# Altium schematic sheet Systolic.SchDoc: Systolic
size A4
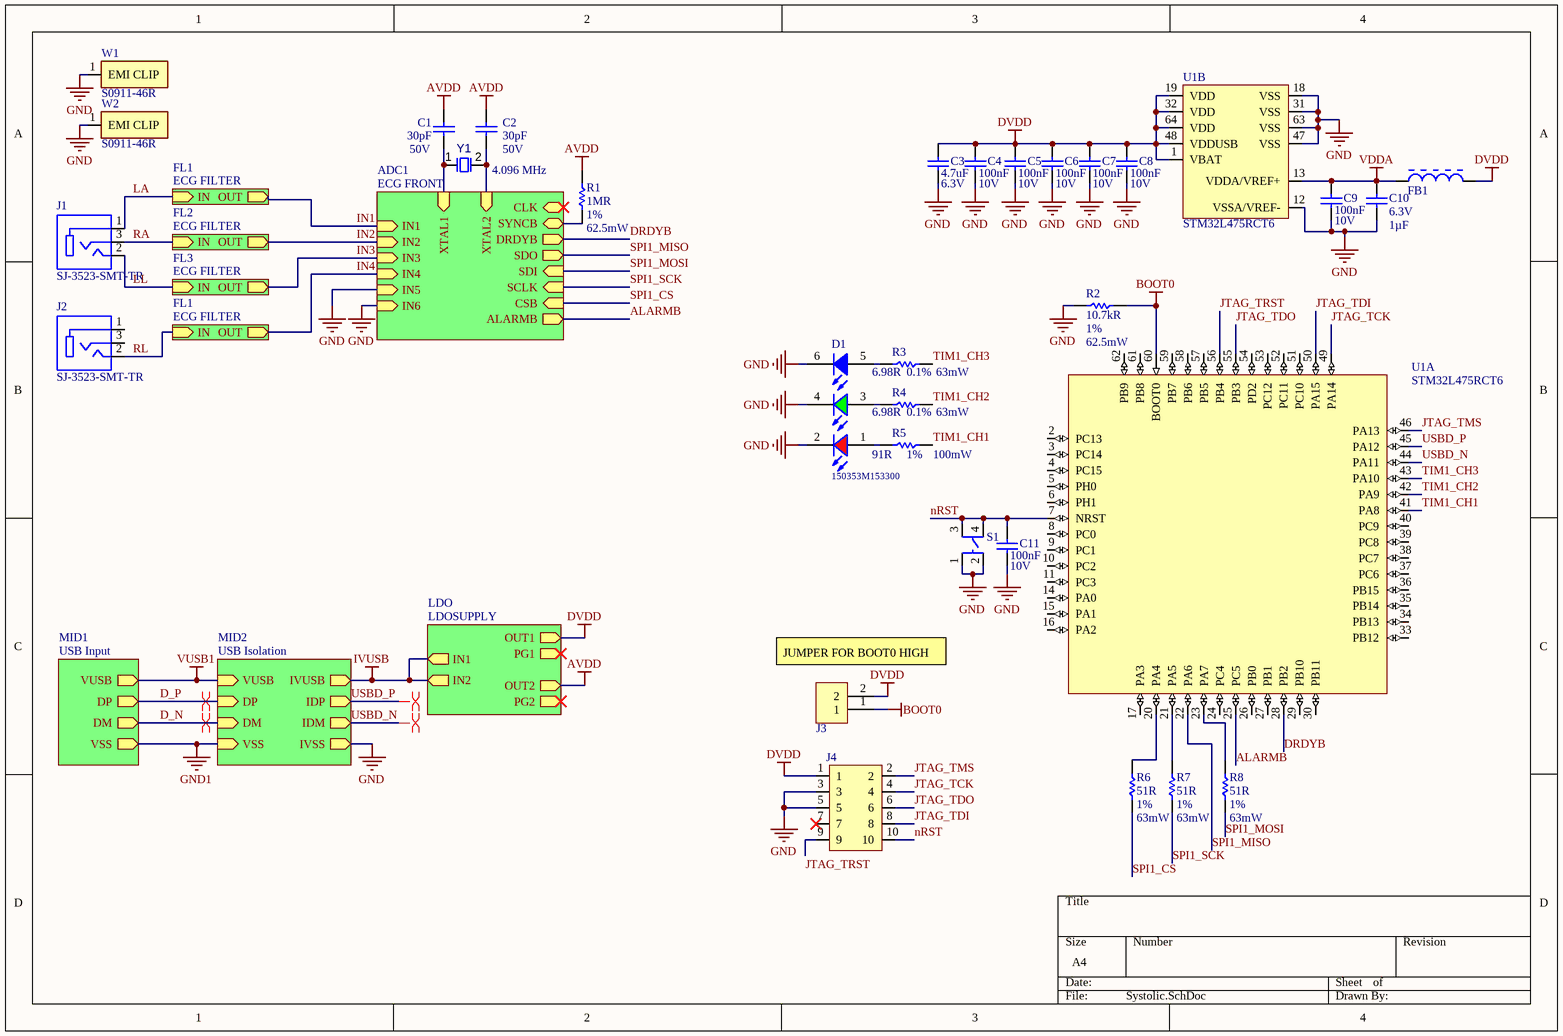
[diagram p0: Systolic.SchDoc]

## Parts
C1  Capacitance: 30pF  Voltage Rating: 50V  [0402 CAPACITOR]  (hidden comment: MC0402N300J500CT)
C2  Capacitance: 30pF  Voltage Rating: 50V  [0402 CAPACITOR]  (hidden comment: MC0402N300J500CT)
C3  Capacitance: 4.7uF  Voltage Rating: 6.3V  [0402 CAPACITOR]  (hidden comment: CL10A475KQ8NNNC)
C4  Capacitance: 100nF  Voltage Rating: 10V  [0402 CAPACITOR]  (hidden comment: C0402C104K8PACTU)
C5  Capacitance: 100nF  Voltage Rating: 10V  [0402 CAPACITOR]  (hidden comment: C0402C104K8PACTU)
C6  Capacitance: 100nF  Voltage Rating: 10V  [0402 CAPACITOR]  (hidden comment: C0402C104K8PACTU)
C7  Capacitance: 100nF  Voltage Rating: 10V  [0402 CAPACITOR]  (hidden comment: C0402C104K8PACTU)
C8  Capacitance: 100nF  Voltage Rating: 10V  [0402 CAPACITOR]  (hidden comment: C0402C104K8PACTU)
C9  Capacitance: 100nF  Voltage Rating: 10V  [0402 CAPACITOR]  (hidden comment: C0402C104K8PACTU)
C10  value 1µF  Voltage Rating (DC): 6.3V  [0402 CAPACITOR]  (hidden comment: C0402C105K9PACTU)
C11  Capacitance: 100nF  Voltage Rating: 10V  [0402 CAPACITOR]  (hidden comment: C0402C104K8PACTU)
D1  150353M153300  [WL-SFTD_3535]
FB1  BLM15AX601SN1D  [0402 RESISTOR]  (value not drawn)
J1  SJ-3523-SMT-TR  [CUI_SJ-3523-SMT-TR]
J2  SJ-3523-SMT-TR  [CUI_SJ-3523-SMT-TR]
J3  SAMTEC-TSW-102-07-X-SJ  [SAMTEC-TSW-102-07-X-S]  (value not drawn)
J4  FTSH-105-01-L-DV-K-P  [FTSH-105-01-L-DV-K-P]  (value not drawn)
R1  Resistance: 1MR  Tolerance: 1%  Power Rating: 62.5mW  [0402 RESISTOR]  (hidden comment: MCWR04X1004FTL)
R2  Resistance: 10.7kR  Tolerance: 1%  Power Rating: 62.5mW  [0402 RESISTOR]  (hidden comment: MCWR04X1072FTL)
R3  Resistance: 6.98R  Tolerance: 0.1%  Power Rating: 63mW  [0603 RESISTOR]  (hidden comment: RN73C1J6R98BTDF)
R4  Resistance: 6.98R  Tolerance: 0.1%  Power Rating: 63mW  [0603 RESISTOR]  (hidden comment: RN73C1J6R98BTDF)
R5  Resistance: 91R  Tolerance: 1%  Power Rating: 100mW  [0603 RESISTOR]  (hidden comment: CRCW060391R0FKEA)
R6  Resistance: 51R  Tolerance: 1%  Power Rating: 63mW  [0402 RESISTOR]  (hidden comment: CRCW040251R0FKED)
R7  Resistance: 51R  Tolerance: 1%  Power Rating: 63mW  [0402 RESISTOR]  (hidden comment: CRCW040251R0FKED)
R8  Resistance: 51R  Tolerance: 1%  Power Rating: 63mW  [0402 RESISTOR]  (hidden comment: CRCW040251R0FKED)
S1  TL3305BF260QG  [TL3305BF260QG-Footprint-1]  (value not drawn)
U1  STM32L475RCT6  [TSQFP50P1200X1200X160-64N]  (parts A,B of 2)
W1  S0911-46R  [S0911-46R-Footprint-1]
W2  S0911-46R  [S0911-46R-Footprint-1]
Y1  Frequency: 4.096 MHz  [Crystal]  (hidden comment: ABLS-4.096MHZ-20-B-4-Y-T)

## Sub-sheets
ADC1 = ECG FRONT: IN1 (in), IN2 (in), IN3 (in), DRDYB (out), SDO (out), SDI (in), SCLK (in), CSB (in), ALARMB (out), CLK (bidir), XTAL1 (in), XTAL2 (in), SYNCB (bidir), IN6 (in), IN4 (in), IN5 (in)
FL1 = ECG FILTER: OUT (out), IN (in)
FL1 = ECG FILTER: OUT (out), IN (in)
FL2 = ECG FILTER: OUT (out), IN (in)
FL3 = ECG FILTER: OUT (out), IN (in)
LDO = LDOSUPPLY: IN1 (out), PG1 (out), PG2 (out), IN2 (out), OUT1 (out), OUT2 (out)
MID1 = USB Input: VUSB (out), DP (out), DM (out), VSS (out)
MID2 = USB Isolation: VUSB (in), DP (in), DM (in), VSS (in), IVUSB (out), IDP (out), IDM (out), IVSS (out)

## Nets
AVDD: C1.2 C2.2 R1.1 ; sheet LDO/OUT2
BOOT0: J3.1 R2.2 U1.60(BOOT0)
DVDD: C3.2 C4.2 C5.2 C6.2 C7.2 C8.2 FB1.2 J3.2 J4.1 U1.1(VBAT) U1.19(VDD) U1.32(VDD) U1.48(VDDUSB) U1.64(VDD) ; sheet LDO/OUT1
GND: C3.1 C4.1 C5.1 C6.1 C7.1 C8.1 C9.1 C10.1 C11.1 D1.2(K) D1.4(K) D1.6(K) J4.3 J4.5 R2.1 S1.1 S1.2 U1.12(VSSA/VREF-) U1.18(VSS) U1.31(VSS) U1.47(VSS) U1.63(VSS) W1.1(EMI_CLIP) W2.1(EMI_CLIP) ; sheet MID2/IVSS, sheet ADC1/IN6, sheet ADC1/IN5
GND1: sheet MID1/VSS, sheet MID2/VSS
IVUSB: sheet MID2/IVUSB, sheet LDO/IN1, sheet LDO/IN2
VDDA: C9.2 C10.2 FB1.1 U1.13(VDDA/VREF+)
VUSB1: sheet MID1/VUSB, sheet MID2/VUSB
ALARMB: U1.25(PC5) ; sheet ADC1/ALARMB
D_N: sheet MID1/DM, sheet MID2/DM
D_P: sheet MID1/DP, sheet MID2/DP
DRDYB: U1.28(PB2) ; sheet ADC1/DRDYB
IN1: sheet ADC1/IN1, sheet FL1/OUT
IN2: sheet ADC1/IN2, sheet FL2/OUT
IN3: sheet ADC1/IN3, sheet FL3/OUT
IN4: sheet ADC1/IN4, sheet FL1/OUT
JTAG_TCK: J4.4 U1.49(PA14)
JTAG_TDI: J4.8 U1.50(PA15)
JTAG_TDO: J4.6 U1.55(PB3)
JTAG_TMS: J4.2 U1.46(PA13)
JTAG_TRST: J4.9 U1.56(PB4)
LA: J1.1 ; sheet FL1/IN
LL: J1.2 ; sheet FL3/IN
nRST: C11.2 J4.10 S1.3 S1.4 U1.7(NRST)
RA: J1.3 ; sheet FL2/IN
RL: J2.2 ; sheet FL1/IN
SPI1_CS: R6.1 ; sheet ADC1/CSB
SPI1_MISO: U1.22(PA6) ; sheet ADC1/SDO
SPI1_MOSI: R8.1 ; sheet ADC1/SDI
SPI1_SCK: R7.1 ; sheet ADC1/SCLK
TIM1_CH1: R5.2 U1.41(PA8)
TIM1_CH2: R4.2 U1.42(PA9)
TIM1_CH3: R3.2 U1.43(PA10)
USBD_N: U1.44(PA11) ; sheet MID2/IDM
USBD_P: U1.45(PA12) ; sheet MID2/IDP
NetC1_1: C1.1 Y1.1 ; sheet ADC1/XTAL1
NetC2_1: C2.1 Y1.2 ; sheet ADC1/XTAL2
NetD1_1: D1.1(A) R5.1
NetD1_3: D1.3(A) R4.1
NetD1_5: D1.5(A) R3.1
NetR1_2: R1.2 ; sheet ADC1/SYNCB
NetR6_2: R6.2 U1.20(PA4)
NetR7_2: R7.2 U1.21(PA5)
NetR8_2: R8.2 U1.23(PA7)

Not connected (* = marked no-connect by the designer): J2 1 3; J4 7*; U1 2(PC13) 3(PC14) 4(PC15) 5(PH0) 6(PH1) 8(PC0) 9(PC1) 10(PC2) 11(PC3) 14(PA0) 15(PA1) 16(PA2) 17(PA3) 24(PC4) 26(PB0) 27(PB1) 29(PB10) 30(PB11) 33(PB12) 34(PB13) 35(PB14) 36(PB15) 37(PC6) 38(PC7) 39(PC8) 40(PC9) 51(PC10) 52(PC11) 53(PC12) 54(PD2) 57(PB5) 58(PB6) 59(PB7) 61(PB8) 62(PB9)

## Layout directives
differential pair; differential pair class USB: D_N, D_P, USBD_N, USBD_P

## Notes on the sheet
- (near J3) JUMPER FOR BOOT0 HIGH

## Library data of the parts
C1 C2 = CMP-001-00092-2: Cap Ceramic 30pF 50V C0G 5% SMD 0402 125°C; Temperature Coefficient: 30ppm/°C; Packaging: Cut Tape; Case/Package: 0402; Min Operating Temperature: -55°C; Number of Pins: 2; Voltage Rating (DC): 50V; Case Code (Imperial): 0402; Max Operating Temperature: 125°C; REACH SVHC: No SVHC; Case Code (Metric): 1005; Width: 0.5mm; Dielectric: C0G; Tolerance: 5%
C3 = CMP-001-00091-2: Cap Ceramic 4.7uF 6.3V X5R 10% SMD 0402 85°C; Max Operating Temperature: 85°C; Radiation Hardening: No; Voltage: 6.3V; Case Code (Metric): 1608; Case/Package: 0603; Tolerance: 10%; Dielectric: X5R; Mount: Surface Mount; Packaging: Tape and Reel; Height: 0.8mm; Thickness: 0.035inch; Length: 1.6mm; Contact Plating: Tin; Package Quantity: 1; Depth: 0.8mm; Min Operating Temperature: -55°C; Width: 0.031inch; Material: Ceramic; Case Code (Imperial): 0603
C4-C9 C11 = CMP-001-00061-5: Cap Ceramic 0.1uF 10V X5R 10% SMD 0402 85°C; Dissipation Factor: 5%; Number of Pins: 2; Case Code (Metric): 1005; Min Operating Temperature: -55°C; Thickness: 0.022inch; Radiation Hardening: No; Packaging: Tape and Reel; Depth: 0.5mm; Voltage: 10V; Lead Pitch: 0.3mm; Voltage Rating (DC): 10V; Mount: Surface Mount,PCB; Max Operating Temperature: 85°C; Termination: SMD/SMT; Case Code (Imperial): 0402; Width: 0.02inch; REACH SVHC: No SVHC; Contact Plating: Tin,Matte; Length: 1mm; Package Quantity: 1; Dielectric: X5R; Tolerance: 10%; Lead Free: Lead Free; Dielectric Material: Ceramic; Case/Package: 0402; Height: 0.5mm
C10 = CMP-009-0032-3: CAP CER 1UF 6.3V 10% X5R 0402; Manufacturer: KEMET; Dielectric Material: Ceramic; ComponentLink2URL: https://datasheet.ciiva.com/11786/0900766b8116eb59-11786028.pdf?src-supplier=RSComponents; Mount: Surface Mount; REACH SVHC: No SVHC; Height: 0.5mm; Max Operating Temperature: 85°C; ComponentLink5Description: https://datasheet.ciiva.com/18192/getdatasheetpartid-127800-18192427.pdf?src-supplier=Verical; Category: Ceramic Capacitors; Package Quantity: 1; Manufacturer Part Number: C0402C105K9PACTU; ComponentLink5URL: https://datasheet.ciiva.com/18192/getdatasheetpartid-127800-18192427.pdf?src-supplier=Verical; Case/Package: 0402; Tolerance: 10%; Packaging: Tape and Reel; ComponentLink4Description: https://datasheet.ciiva.com/7747/40889-7747623.pdf?src-supplier=Element14; Width: 0.02inch; RoHS: Yes; Depth: 0.5mm; ComponentLink1URL: https://datasheet.ciiva.com/28645/1789732-28645392.pdf?src-supplier=Element14; Length: 1mm; Source: MyLib.SchLib; Stock 1: 76830; Lead Pitch: 0.3mm; Pins: 2; Thickness: 0.022inch; Termination: SMD/SMT; ComponentLink3URL: https://datasheet.ciiva.com/7747/kem-c1006-x5r-smd-7747445.pdf?src-supplier=Element14; Pricing 1: 10=0.02950, 100=0.01910, 500=0.01410, 2500=0.01080, 5000=0.00930 (GBP); ComponentLink1Description: https://datasheet.ciiva.com/28645/1789732-28645392.pdf?src-supplier=Element14; ComponentLink2Description: https://datasheet.ciiva.com/11786/0900766b8116eb59-11786028.pdf?src-supplier=RSComponents; Design Item ID: C0402C105K9PACTU; Radiation Hardening: No; Voltage Rating: 6.3V; ComponentLink4URL: https://datasheet.ciiva.com/7747/40889-7747623.pdf?src-supplier=Element14; Min Operating Temperature: -55°C; Dielectric: X5R; Voltage: 6.3V; ComponentLink3Description: https://datasheet.ciiva.com/7747/kem-c1006-x5r-smd-7747445.pdf?src-supplier=Element14; Lead Free: Lead Free
D1 = CMP-080-0003-1: WL-SFTD SMT Full-color Top LED Diffused, size 3535, Red & Green & Blue, 120deg; Dominant Wavelength typ.: Blue:470nm, Green:520nm, Red:625nm; Peak Wavelength typ.: Blue:465nm, Green:515nm, Red:635nm; Luminous Intensity typ.: Blue:400mcd, Green:1900mcd, Red:800mcd; Chip Technology: AlInGaP + GaN; Forward Voltage typ.: Blue:3.2V, Green:3.2V, Red:2V; Published Date: December 2019; Viewing Angle: 120deg; ComponentLink2Description: Datasheet; ComponentLink2URL: https://www.we-online.com/catalog/datasheet/150353M153300.pdf; ComponentLink1Description: Manufacturer; Part Number: 150353M153300; Publisher: Wurth Elektronik; ComponentLink1URL: http://www.we-online.de; Operating Temperature: -40 to +85degC; Packaging: Tape and Reel; Source: WL-SFTD.SchLib; Mounting Technology: SMT; Emitting Color: Red & Green & Blue; Design Item ID: 150353M153300; Size: 3535
FB1 = CMP-006-00023-1: Ferrite Beads Multi-Layer 600Ohm 25% 100MHz 500mA 340mOhm DCR 0402 T/R; Number of Lines: 1; DC Resistance (DCR): 340mR; Material: Steel,Ferrite; Impedance: 600R; Core Material: Ferrite; Width: 0.5mm; Lead Free: Lead Free; Case/Package: 0402; Max Current Rating: 500mA; Number of Pins: 2; Case Code (Metric): 1005; Case Code (Imperial): 0402; Min Operating Temperature: -55°C; REACH SVHC: No SVHC; Length: 1mm; Termination: SMD/SMT; Package Quantity: 1; Tolerance: 25%; Current Rating: 500mA; Depth: 0.5mm; Height: 0.5mm; Max Operating Temperature: 125°C; Number of Circuits: 1; Test Frequency: 100MHz; Packaging: Tape and Reel; Max DC Current: 500mA
J1 J2 = CMP-023-0000-1: CONN JACK STEREO 3.5MM SMD R/A; Manufacturer 1: CUI; MF: CUI Devices; Number of Conductors: 3; Shielding: Unshielded; Current Rating: 1A; Number of Ports: 1; Gender: Female; ComponentLink2Description: https://datasheet.ciiva.com/7356/sj-352x-smt-series-7356569.pdf?src-supplier=Digi-Key; Availability: Unavailable; Case/Package: LGA-10 STMicroelectronics; ComponentLink2URL: https://datasheet.ciiva.com/7356/sj-352x-smt-series-7356569.pdf?src-supplier=Digi-Key; Price: None; Color: Black; ComponentLink1URL: https://datasheet.ciiva.com/7356/sj-352x-smt-series-7356553.pdf?src-supplier=Digi-Key; Pricing 1: 1000=0.51360, 2000=0.48150, 3000=0.46545, 5000=0.44940, 10000=0.42693, 25000=0.41730 (USD); Stock 1: 40782; Connector Type: Jack; Termination: Solder; Design Item ID: SJ-3523-SMT-TR; Lead Free: Lead Free; Contact Plating: Silver; Value: *; MP: SJ-3523-SMT-TR; ComponentLink1Description: https://datasheet.ciiva.com/7356/sj-352x-smt-series-7356553.pdf?src-supplier=Digi-Key; SnapEDA_Link: https://www.snapeda.com/parts/SJ-3523-SMT-TR/CUI%20Devices/view-part/251570/?ref=snap; Category: Connectors; Mount: Surface Mount; Packaging: Cut Tape; CUI_purchase_URL: https://www.cuidevices.com/product/interconnect/connectors/audio-connectors/jacks/sj-352x-smt-series?utm_source=snapeda.com&utm_medium=referral&utm_campaign=snapedaBOM; RoHS: Yes; Manufacturer Part Number 1: SJ-3523-SMT-TR; Source: SnapEDAsch.SchLib; Orientation: Horizontal
J3 = CMP-087-0000-1: Component Type: Standard; Design Item ID: SAMTEC-TSW-102-07-X-SJ; Source: SAMTEC-TSW-102-07-X-S.SCHLIB; Pin Count: 2
J4 = CMP-066-0000-6: TERMINAL STRIP, .050"(1.27mm) PITCH, 10 PINS, KEYED; MANUFACTURER: SAMTEC; PCB DECAL: FTSH-105-01-XXX-DV-K; Design Item ID: FTSH-105-01-L-DV-K-P; Source: FTSH-105-01-L-DV-K-P.SCHLIB; CREATED: November 30, 2016 - Wendy Xin
R1 = CMP-009-00177-1: 1MR 0402; Voltage Rating (DC): 50V; Temperature Coefficient: 100ppm/°C; Case Code (Metric): 1005; Case/Package: 0402; Voltage Rating: 50V; Mount: Surface Mount; Packaging: Cut Tape; REACH SVHC: No SVHC; Composition: Thick Film; Case Code (Imperial): 0402
R2 = CMP-009-00185-1: MULTICOMP - MCMR04X24R0FTL - RES, CERAMIC 10.7kR, 1%, 0.063W, 0402; Voltage Rating (DC): 50V; Temperature Coefficient: 100ppm/°C; Case Code (Metric): 1005; Composition: Ceramic; REACH SVHC: No SVHC; Case Code (Imperial): 0402; Packaging: Cut Tape; Voltage Rating: 50V; Case/Package: 0402
R3 R4 = CMP-009-00193-1: RES, THIN FILM 6.98R, 0.1%, 0.063W, 0603; Voltage Rating (DC): 50V; Temperature Coefficient: 10ppm/°C; Number of Resistors: 1; Max Operating Temperature: 155°C; Case Code (Metric): 1608; Length: 1.55mm; Weight: 7.1E-05oz; Composition: Thin Film; Height: 0.45mm; Case Code (Imperial): 0603; Case/Package: 0603; Mount: Surface Mount; Min Operating Temperature: -55°C; Voltage Rating: 50V; Termination: Solder; Width: 0.8mm; Package Quantity: 1000; Packaging: Tape and Reel; ELV: Compliant; Number of Terminations: 2
R5 = CMP-009-00192-1: RES, THICK FILM 91R, 1%, 0.1W, 0603; Voltage Rating: 75V; Temperature Coefficient: 100ppm/°C; Height: 0.45mm; Packaging: Tape and Reel; Package Quantity: 10; Military Standard: Not; Composition: Thick Film; Contact Plating: Tin; Case Code (Imperial): 0603; Radiation Hardening: No; Weight: 7.1E-05oz; Case Code (Metric): 1608; Case/Package: 0603; REACH SVHC: Unknown; Termination: SMD/SMT; Lead Free: Lead Free; Depth: 0.85mm; Length: 1.55mm; Max Operating Temperature: 155°C; Min Operating Temperature: -55°C; Voltage Rating (DC): 75V; Number of Pins: 2; Number of Terminations: 2; Features: Automotive AEC-Q200; Width: 0.033inch; Max Power Dissipation: 100mW
R6-R8 = CMP-009-00186-1: 51R 0402 AEC-Q200; Voltage Rating (DC): 50V; Temperature Coefficient: 100ppm/°C; Lead Free: Lead Free; REACH SVHC: Unknown; Package Quantity: 10; Case Code (Imperial): 0402; Case Code (Metric): 1005; Military Standard: Not; Length: 1mm; Width: 0.5mm; Number of Terminations: 2; Voltage Rating: 50V; Weight: 2.3E-05oz; Case/Package: 0402; Max Operating Temperature: 155°C; Max Power Dissipation: 63mW; Termination: SMD/SMT; Depth: 0.5mm; Packaging: Tape and Reel; Features: Automotive AEC-Q200; Min Operating Temperature: -55°C; Composition: Thick Film; Radiation Hardening: No; Number of Pins: 2; Height: 0.35mm; Contact Plating: Tin
S1 = CMP-011-00013-1: Switch Tactile N.O. SPST Round Button Gull Wing 0.05A 12VDC 2.55N SMD T/R; Illumination Type: Non-Illuminated; Mechanical Life: 200000Cycles; Actuator Type: Standard; Operating Force: 260gf; Switch Travel: 0.2mm; Switch Function: Off-Mom; Lead Free: Lead Free; Throw Configuration: SPST; Termination: Gull Wing; Max Operating Temperature: 70°C; Mount: Surface Mount; Min Operating Temperature: -20°C; Packaging: Tape and Reel
U1 = CMP-020-00023-2: Ultra-low-power with FPU ARM Cortex-M4 MCU 80 MHz with 256 Kbytes Flash, USB OTG; Oscillator Type: Internal; Frequency: 80MHz; Peripherals: Brown-out Detect/Reset,PWM,WDT,DMA; Interface: I2C,SPI,USB,IrDA,MMC,SD,UART,USART; Memory Size: 256KB; Number of I/Os: 51; Core Architecture: ARM; Max Operating Temperature: 85°C; Min Operating Temperature: -40°C; Memory Type: FLASH; Case/Package: LQFP; Packaging: Tray
W1 W2 = CMP-00028-00008-1: Compact RFI Shield Clip Socket Surface Mount Beryllium Copper T/R
Y1 = CMP-003-00032-1: Load Capacitance: 20 pF; Frequency Tolerance: 30ppm